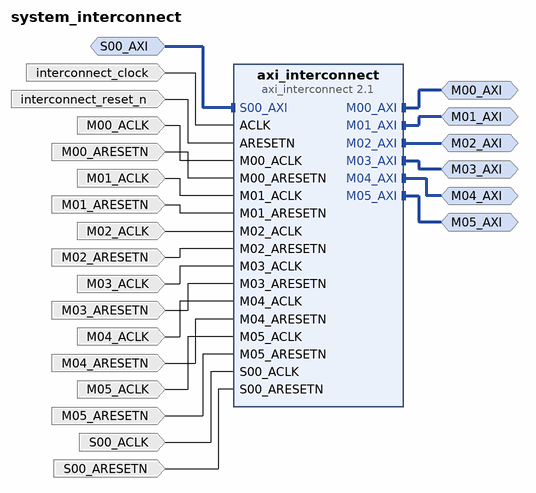
[diagram p0: block diagram of the top level]
# Vivado block design system_interconnect, xczu9eg-ffvb1156-2-e, Vivado 2022.1
create_bd_design system_interconnect

create_bd_intf_port -mode Master -vlnv xilinx.com:interface:aximm_rtl:1.0 M00_AXI
set_property -dict [list \
  CONFIG.ADDR_WIDTH 32 \
  CONFIG.DATA_WIDTH 32 \
  CONFIG.FREQ_HZ 40000000 \
  CONFIG.NUM_READ_OUTSTANDING 2 \
  CONFIG.NUM_WRITE_OUTSTANDING 2 \
  CONFIG.PROTOCOL AXI4 \
] [get_bd_intf_ports M00_AXI]
create_bd_intf_port -mode Master -vlnv xilinx.com:interface:aximm_rtl:1.0 M01_AXI
set_property -dict [list \
  CONFIG.ADDR_WIDTH 32 \
  CONFIG.DATA_WIDTH 32 \
  CONFIG.FREQ_HZ 40000000 \
  CONFIG.NUM_READ_OUTSTANDING 2 \
  CONFIG.NUM_WRITE_OUTSTANDING 2 \
  CONFIG.PROTOCOL AXI4 \
] [get_bd_intf_ports M01_AXI]
create_bd_intf_port -mode Slave -vlnv xilinx.com:interface:aximm_rtl:1.0 S00_AXI
set_property -dict [list \
  CONFIG.ADDR_WIDTH 32 \
  CONFIG.ARUSER_WIDTH 0 \
  CONFIG.AWUSER_WIDTH 0 \
  CONFIG.BUSER_WIDTH 0 \
  CONFIG.DATA_WIDTH 32 \
  CONFIG.FREQ_HZ 125000000 \
  CONFIG.HAS_BRESP 1 \
  CONFIG.HAS_BURST 1 \
  CONFIG.HAS_CACHE 1 \
  CONFIG.HAS_LOCK 1 \
  CONFIG.HAS_PROT 1 \
  CONFIG.HAS_QOS 1 \
  CONFIG.HAS_REGION 0 \
  CONFIG.HAS_RRESP 1 \
  CONFIG.HAS_WSTRB 1 \
  CONFIG.ID_WIDTH 0 \
  CONFIG.MAX_BURST_LENGTH 256 \
  CONFIG.NUM_READ_OUTSTANDING 2 \
  CONFIG.NUM_READ_THREADS 1 \
  CONFIG.NUM_WRITE_OUTSTANDING 2 \
  CONFIG.NUM_WRITE_THREADS 1 \
  CONFIG.PROTOCOL AXI4 \
  CONFIG.READ_WRITE_MODE READ_WRITE \
  CONFIG.RUSER_BITS_PER_BYTE 0 \
  CONFIG.RUSER_WIDTH 0 \
  CONFIG.SUPPORTS_NARROW_BURST 1 \
  CONFIG.WUSER_BITS_PER_BYTE 0 \
  CONFIG.WUSER_WIDTH 0 \
] [get_bd_intf_ports S00_AXI]
create_bd_intf_port -mode Master -vlnv xilinx.com:interface:aximm_rtl:1.0 M02_AXI
set_property -dict [list \
  CONFIG.ADDR_WIDTH 32 \
  CONFIG.DATA_WIDTH 32 \
  CONFIG.FREQ_HZ 125000000 \
  CONFIG.NUM_READ_OUTSTANDING 2 \
  CONFIG.NUM_WRITE_OUTSTANDING 2 \
  CONFIG.PROTOCOL AXI4 \
] [get_bd_intf_ports M02_AXI]
create_bd_intf_port -mode Master -vlnv xilinx.com:interface:aximm_rtl:1.0 M03_AXI
set_property -dict [list \
  CONFIG.ADDR_WIDTH 32 \
  CONFIG.DATA_WIDTH 32 \
  CONFIG.FREQ_HZ 125000000 \
  CONFIG.NUM_READ_OUTSTANDING 2 \
  CONFIG.NUM_WRITE_OUTSTANDING 2 \
  CONFIG.PROTOCOL AXI4 \
] [get_bd_intf_ports M03_AXI]
create_bd_intf_port -mode Master -vlnv xilinx.com:interface:aximm_rtl:1.0 M04_AXI
set_property -dict [list \
  CONFIG.ADDR_WIDTH 32 \
  CONFIG.DATA_WIDTH 32 \
  CONFIG.FREQ_HZ 125000000 \
  CONFIG.NUM_READ_OUTSTANDING 2 \
  CONFIG.NUM_WRITE_OUTSTANDING 2 \
  CONFIG.PROTOCOL AXI4 \
] [get_bd_intf_ports M04_AXI]
create_bd_intf_port -mode Master -vlnv xilinx.com:interface:aximm_rtl:1.0 M05_AXI
set_property -dict [list \
  CONFIG.ADDR_WIDTH 32 \
  CONFIG.DATA_WIDTH 32 \
  CONFIG.FREQ_HZ 125000000 \
  CONFIG.NUM_READ_OUTSTANDING 2 \
  CONFIG.NUM_WRITE_OUTSTANDING 2 \
  CONFIG.PROTOCOL AXI4 \
] [get_bd_intf_ports M05_AXI]
create_bd_port -dir I -type clk interconnect_clock
set_property -dict {CONFIG.FREQ_HZ 125000000} [get_bd_ports interconnect_clock]
create_bd_port -dir I -type rst interconnect_reset_n
set_property -dict {CONFIG.POLARITY ACTIVE_LOW} [get_bd_ports interconnect_reset_n]
create_bd_port -dir I -type clk S00_ACLK
set_property -dict {CONFIG.ASSOCIATED_RESET S00_ARESETN CONFIG.FREQ_HZ 125000000} [get_bd_ports S00_ACLK]
create_bd_port -dir I -type rst S00_ARESETN
create_bd_port -dir I -type clk M00_ACLK
set_property -dict {CONFIG.FREQ_HZ 40000000} [get_bd_ports M00_ACLK]
create_bd_port -dir I -type rst M00_ARESETN
create_bd_port -dir I -type clk M01_ACLK
set_property -dict {CONFIG.FREQ_HZ 40000000} [get_bd_ports M01_ACLK]
create_bd_port -dir I -type rst M01_ARESETN
create_bd_port -dir I -type clk M02_ACLK
set_property -dict {CONFIG.ASSOCIATED_RESET M02_ARESETN CONFIG.FREQ_HZ 125000000} [get_bd_ports M02_ACLK]
create_bd_port -dir I -type rst M02_ARESETN
create_bd_port -dir I -type rst M03_ARESETN
create_bd_port -dir I -type rst M04_ARESETN
create_bd_port -dir I -type clk M04_ACLK
set_property -dict {CONFIG.ASSOCIATED_RESET M04_ARESETN CONFIG.FREQ_HZ 125000000} [get_bd_ports M04_ACLK]
create_bd_port -dir I -type clk M03_ACLK
set_property -dict {CONFIG.ASSOCIATED_RESET M03_ARESETN CONFIG.FREQ_HZ 125000000} [get_bd_ports M03_ACLK]
create_bd_port -dir I -type clk M05_ACLK
set_property -dict {CONFIG.ASSOCIATED_RESET M05_ARESETN CONFIG.FREQ_HZ 125000000} [get_bd_ports M05_ACLK]
create_bd_port -dir I -type rst M05_ARESETN

create_bd_cell -type ip -vlnv xilinx.com:ip:axi_interconnect:2.1 axi_interconnect
set_property -dict {CONFIG.ENABLE_ADVANCED_OPTIONS 0 CONFIG.NUM_MI 6} [get_bd_cells axi_interconnect]

# ---- connections ----

connect_bd_intf_net [get_bd_intf_ports S00_AXI] [get_bd_intf_pins axi_interconnect/S00_AXI]
connect_bd_intf_net -intf_net axi_interconnect_0_M00_AXI [get_bd_intf_ports M00_AXI] [get_bd_intf_pins axi_interconnect/M00_AXI]
connect_bd_intf_net -intf_net axi_interconnect_0_M01_AXI [get_bd_intf_ports M01_AXI] [get_bd_intf_pins axi_interconnect/M01_AXI]
connect_bd_intf_net [get_bd_intf_ports M02_AXI] [get_bd_intf_pins axi_interconnect/M02_AXI]
connect_bd_intf_net [get_bd_intf_ports M03_AXI] [get_bd_intf_pins axi_interconnect/M03_AXI]
connect_bd_intf_net [get_bd_intf_ports M04_AXI] [get_bd_intf_pins axi_interconnect/M04_AXI]
connect_bd_intf_net [get_bd_intf_ports M05_AXI] [get_bd_intf_pins axi_interconnect/M05_AXI]
connect_bd_net -net ACLK_1 [get_bd_ports interconnect_clock] [get_bd_pins axi_interconnect/ACLK]
connect_bd_net -net ARESETN_1 [get_bd_ports interconnect_reset_n] [get_bd_pins axi_interconnect/ARESETN]
connect_bd_net [get_bd_ports M00_ACLK] [get_bd_pins axi_interconnect/M00_ACLK]
connect_bd_net [get_bd_ports M00_ARESETN] [get_bd_pins axi_interconnect/M00_ARESETN]
connect_bd_net [get_bd_ports M01_ACLK] [get_bd_pins axi_interconnect/M01_ACLK]
connect_bd_net [get_bd_ports M01_ARESETN] [get_bd_pins axi_interconnect/M01_ARESETN]
connect_bd_net [get_bd_ports M02_ACLK] [get_bd_pins axi_interconnect/M02_ACLK]
connect_bd_net [get_bd_ports M02_ARESETN] [get_bd_pins axi_interconnect/M02_ARESETN]
connect_bd_net [get_bd_ports M03_ACLK] [get_bd_pins axi_interconnect/M03_ACLK]
connect_bd_net [get_bd_ports M03_ARESETN] [get_bd_pins axi_interconnect/M03_ARESETN]
connect_bd_net [get_bd_ports M04_ACLK] [get_bd_pins axi_interconnect/M04_ACLK]
connect_bd_net [get_bd_ports M04_ARESETN] [get_bd_pins axi_interconnect/M04_ARESETN]
connect_bd_net [get_bd_ports M05_ACLK] [get_bd_pins axi_interconnect/M05_ACLK]
connect_bd_net [get_bd_ports M05_ARESETN] [get_bd_pins axi_interconnect/M05_ARESETN]
connect_bd_net [get_bd_ports S00_ACLK] [get_bd_pins axi_interconnect/S00_ACLK]
connect_bd_net [get_bd_ports S00_ARESETN] [get_bd_pins axi_interconnect/S00_ARESETN]

# ---- address map ----
assign_bd_address -offset 0x00000000 -range 256M -target_address_space [get_bd_addr_spaces S00_AXI] [get_bd_addr_segs M00_AXI/Reg]
assign_bd_address -offset 0x10000000 -range 256M -target_address_space [get_bd_addr_spaces S00_AXI] [get_bd_addr_segs M01_AXI/Reg]
assign_bd_address -offset 0x20000000 -range 256M -target_address_space [get_bd_addr_spaces S00_AXI] [get_bd_addr_segs M02_AXI/Reg]
assign_bd_address -offset 0x30000000 -range 256M -target_address_space [get_bd_addr_spaces S00_AXI] [get_bd_addr_segs M03_AXI/Reg]
assign_bd_address -offset 0xF0000000 -range 64K -target_address_space [get_bd_addr_spaces S00_AXI] [get_bd_addr_segs M04_AXI/Reg]
assign_bd_address -offset 0xFFFF0000 -range 64K -target_address_space [get_bd_addr_spaces S00_AXI] [get_bd_addr_segs M05_AXI/Reg]

validate_bd_design
save_bd_design
